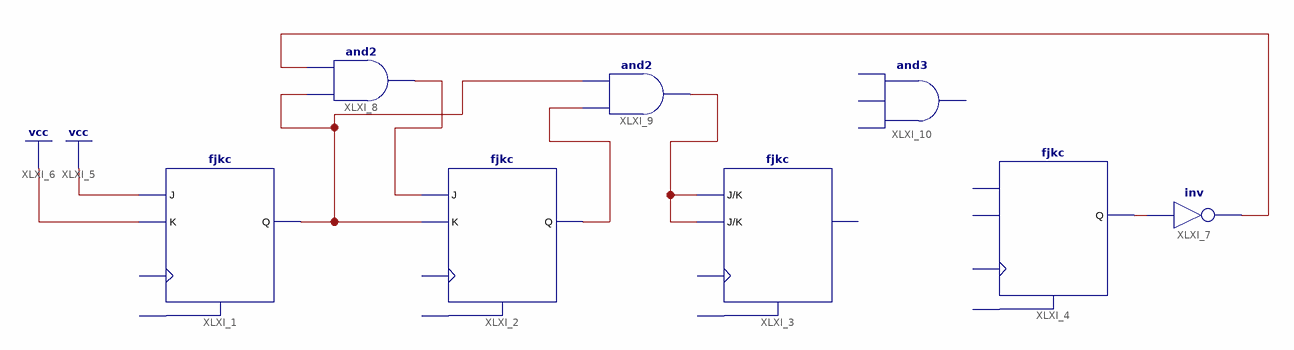
[diagram p0: schematic sheet 1]
// Xilinx ISE schematic Counter_EAKLAEW.sch (spartan6) as structural Verilog: 8 symbols, 0 ports
module Counter_EAKLAEW (
);

  wire XLXN_4, XLXN_5, XLXN_6, XLXN_7, XLXN_8, XLXN_9;

  fjkc XLXI_1 (.J(1'b1), .K(1'b1), .Q(XLXN_5));  // open: C, CLR
  fjkc XLXI_2 (.J(XLXN_7), .K(XLXN_5), .Q(XLXN_8));  // open: C, CLR
  fjkc XLXI_3 (.J(XLXN_9), .K(XLXN_9));  // open: C, CLR, Q
  fjkc XLXI_4 (.Q(XLXN_4));  // open: C, CLR, J, K
  not XLXI_7 (XLXN_6, XLXN_4);
  and XLXI_8 (XLXN_7, XLXN_5, XLXN_6);
  and XLXI_9 (XLXN_9, XLXN_8, XLXN_5);
  // and3 XLXI_10 is placed but not wired
endmodule
